# EAGLE design esp8266 (EAGLE 7.4.0)
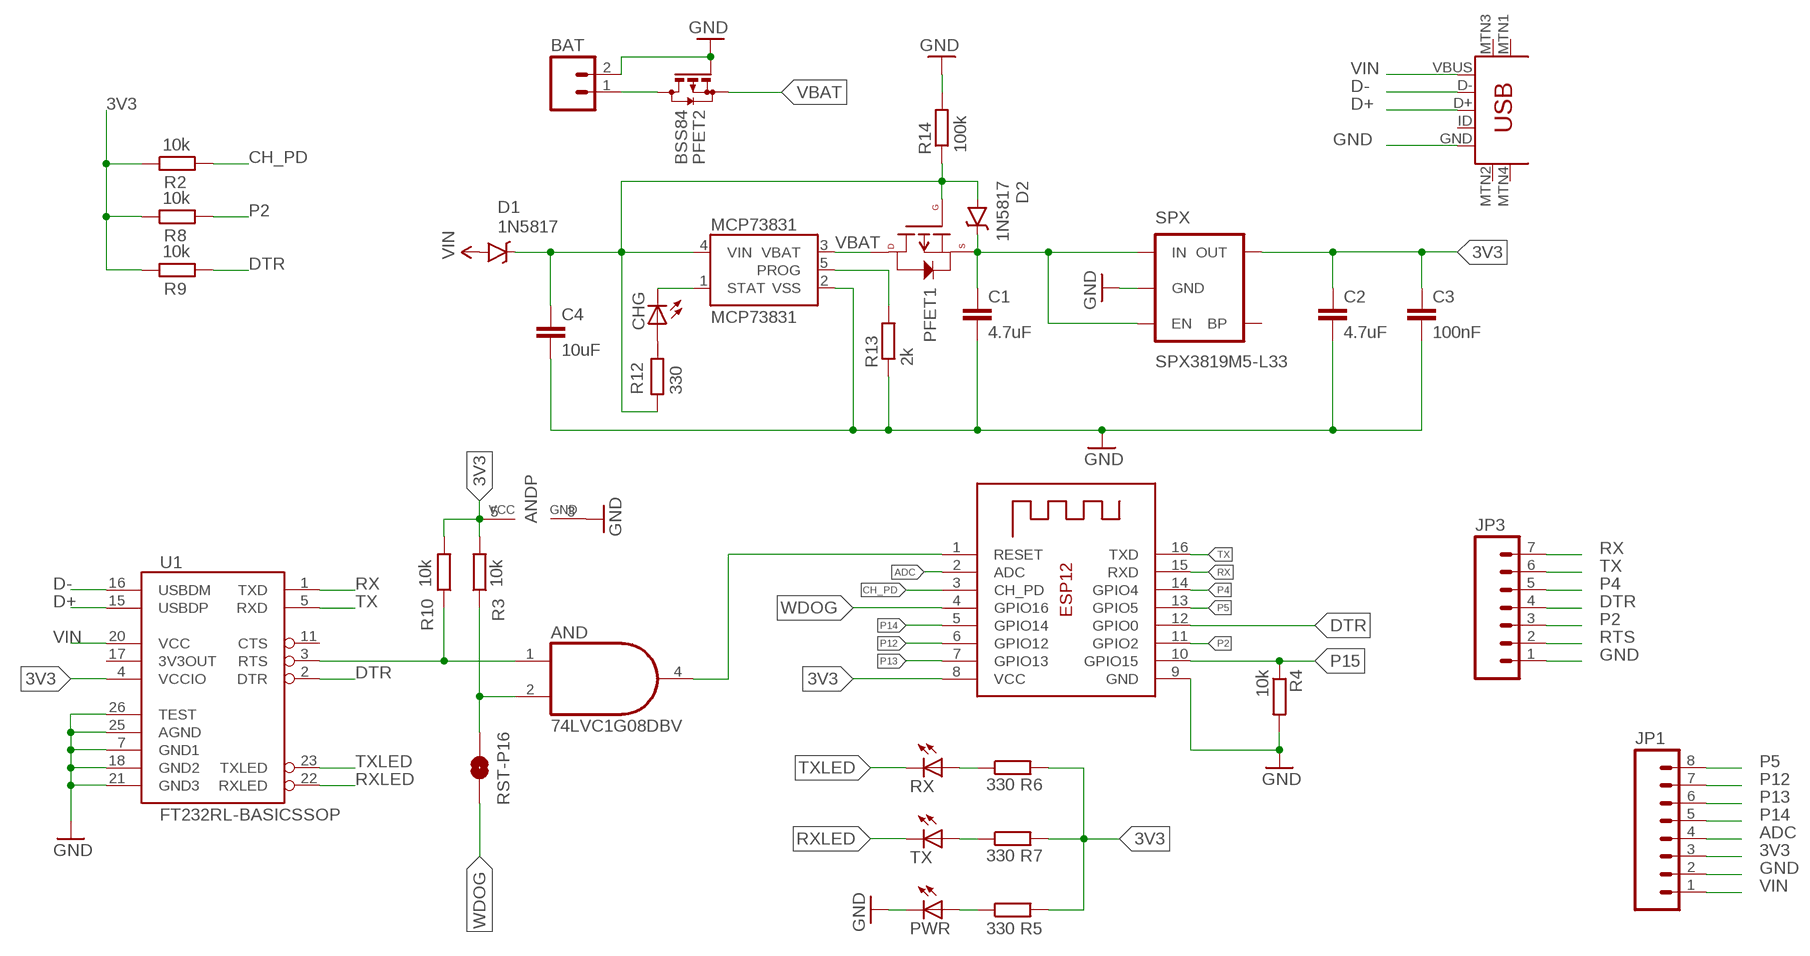
[diagram p0: schematic, sheet 1]

## Parts
AND  74LVC1G08DBV  [SOT23-5]
BAT  M02LOCK  [1X02_LOCK]
C1  4.7uF  C-EUC0805  [C0805]
C2  4.7uF  C-EUC0805  [C0805]
C3  100nF  C-EUC0805  [C0805]
C4  10uF  C-EUC0805  [C0805]
CHG  LEDCHIPLED_0805  [CHIPLED_0805]
D1  1N5817  DIODE-SCHOTTKY-MBRA140  [SMA-DIODE]
D2  1N5817  DIODE-SCHOTTKY-MBRA140  [SMA-DIODE]
ESP8266-07/12  ESP-12  [ESP-12]
JP1  M08LOCK  [1X08_LOCK]
JP3  M07LOCK  [1X07_LOCK]
MCP73831  MCP73831  [SOT23-5]
MINIUSB  USB-MINIB-5PIN  [USB-MINIB]
PFET1  P-CHANNEL-MOSFET  [SOT23-3]
PFET2  BSS84  [SOT23]
PWR  LEDCHIPLED_0805  [CHIPLED_0805]
R2  10k  R-EU_R0805  [R0805]
R3  10k  R-EU_R0805  [R0805]
R4  10k  R-EU_R0805  [R0805]
R5  330  R-EU_R0805  [R0805]
R6  330  R-EU_R0805  [R0805]
R7  330  R-EU_R0805  [R0805]
R8  10k  R-EU_R0805  [R0805]
R9  10k  R-EU_R0805  [R0805]
R10  10k  R-EU_R0805  [R0805]
R12  330  R-EU_R0805  [R0805]
R13  2k  R-EU_R0805  [R0805]
R14  100k  R-EU_R0805  [R0805]
RST-P16  SOLDERJUMPERNO  [SJ_2S-NO]
RX  LEDCHIPLED_0805  [CHIPLED_0805]
SPX  SPX3819M5-L33  V_REG_LDOSMD  [SOT23-5]
TX  LEDCHIPLED_0805  [CHIPLED_0805]
U1  FT232RL-BASICSSOP  [SSOP28DB]

## Nets
3V3 [vreg]: AND.5(VCC) C2.1 C3.1 ESP8266-07/12.8(VCC) JP1.3 R2.1 R3.2 R5.2 R6.2 R7.2 R8.1 R9.1 R10.2 SPX.5(OUT) U1.4(VCCIO)
ADC: ESP8266-07/12.2(ADC) JP1.4
CH_PD: ESP8266-07/12.3(CH_PD) R2.2
D+: MINIUSB.D+ U1.15(USBDP)
D-: MINIUSB.D- U1.16(USBDM)
DTR: ESP8266-07/12.12(GPIO0) JP3.4 R9.2 U1.2(DTR)
FTDI_RTS: AND.1(I0) R10.1 U1.3(RTS)
GND: AND.3(GND) BAT.2 C1.2 C2.2 C3.2 C4.2 ESP8266-07/12.9(GND) JP1.2 JP3.1 MCP73831.2(VSS) MINIUSB.GND PFET2.1(G) PWR.C R4.2 R13.1 R14.2 SPX.2(GND) U1.7(GND1) U1.18(GND2) U1.21(GND3) U1.25(AGND) U1.26(TEST)
N$1: PWR.A R5.1
N$2 [vcc]: C4.1 D1.C D2.A MCP73831.4(VIN) PFET1.1(G) R12.1 R14.1
N$3: CHG.A R12.2
N$4: AND.2(I1) R3.1 RST-P16.1
N$5: BAT.1 PFET2.3(D)
N$6: R6.1 RX.A
N$7: R7.1 TX.A
N$8: CHG.C MCP73831.1(STAT)
N$10: MCP73831.5(PROG) R13.2
P2: ESP8266-07/12.11(GPIO2) JP3.3 R8.2
P4: ESP8266-07/12.14(GPIO4) JP3.5
P5: ESP8266-07/12.13(GPIO5) JP1.8
P12: ESP8266-07/12.6(GPIO12) JP1.7
P13: ESP8266-07/12.7(GPIO13) JP1.6
P14: ESP8266-07/12.5(GPIO14) JP1.5
P15: ESP8266-07/12.10(GPIO15) R4.1
RTS: AND.4(O) ESP8266-07/12.1(RESET) JP3.2
RX: ESP8266-07/12.15(RXD) JP3.7 U1.1(TXD)
RXLED: TX.C U1.22(RXLED)
TX: ESP8266-07/12.16(TXD) JP3.6 U1.5(RXD)
TXLED: RX.C U1.23(TXLED)
VBAT: MCP73831.3(VBAT) PFET1.3(D) PFET2.2(S)
VIN [vcc]: D1.A JP1.1 MINIUSB.VBUS U1.20(VCC)
VRIN [vcc]: C1.1 D2.C PFET1.2(S) SPX.1(IN) SPX.3(EN)
WDOG: ESP8266-07/12.4(GPIO16) RST-P16.2
Unconnected: MINIUSB.ID MINIUSB.MTN1(MTN2) MINIUSB.MTN2(MTN3) MINIUSB.MTN3(MTN1) MINIUSB.MTN4 SPX.4(BP) U1.11(CTS) U1.17(3V3OUT)

## Library data of the parts
AND = 74xx-little-us:74*1G08: 2-input AND gate
BAT = SparkFun-Connectors:M02: Standard 2-pin 0.1" header. Use with - straight break away headers ( PRT-00116) - right angle break away headers (PRT-00553) - swiss pins (PRT-00743) - machine pins (PRT-00117) - female headers (PRT-00115) Molex polarized connector foot print use with: PRT-08233 with associated crimp pins and housings. 2.54_SCREWTERM for use with PRT-10571. 3.5mm Screw Terminal footprints for PRT-08084 5mm Screw Terminal footprints for use with PRT-08432
C1-C4 = rcl:C-EU: CAPACITOR, European symbol
CHG PWR RX TX = adafruit:LED: LED OSRAM: - CHIPLED LG R971, LG N971, LY N971, LG Q971, LY Q971, LO R971, LY R971 LH N974, LH R974 LS Q976, LO Q976, LY Q976 LO Q996 - Hyper CHIPLED LW Q18S LB Q993, LB Q99A, LB R99A - SideLED LS A670, LO A670, LY A670, LG A670, LP A670 LB A673, LV A673, LT A673, LW A673 LH A674 LY A675 LS A676, LA A676, LO A676, LY A676, LW A676 LS A679, LY A679, LG A679 - Hyper Micro SIDELED® LS Y876, LA Y876, LO Y876, LY Y876 LT Y87S - SmartLED LW L88C, LW L88S LB L89C, LB L89S, LG L890 LS L89K, LO L89K, LY L89K LS L896, LA L896, LO L896, LY L896 - TOPLED LS T670, LO T670, LY T670, LG T670, LP T670 LSG T670, LSP T670, LSY T670, LOP T670, LYG T670 LG T671, LOG T671, LSG T671 LB T673, LV T673, LT T673, LW T673 LH T674 LS T676, LA T676, LO T676, LY T676, LB T676, LH T676, LSB T676, LW T676 LB T67C, LV T67C, LT T67C, LS T67K, LO T67K, LY T67K, LW E67C LS E67B, LA E67B, LO E67B, LY E67B, LB E67C, LV E67C, LT E67C LW T67C LS T679, LY T679, LG T679 LS T770, LO T770, LY T770, LG T770, LP T770 LB T773, LV T773, LT T773, LW T773 LH T774 LS E675, LA E675, LY E675, LS T675 LS T776, LA T776, LO T776, LY T776, LB T776 LHGB T686 LT T68C, LB T68C - Hyper Mini TOPLED® LB M676 - Mini TOPLED Santana® LG M470 LS M47K, LO M47K, LY M47K Source: http://www.osram.convergy.de/
D1 D2 = SparkFun-DiscreteSemi:DIODE-SCHOTTKY: Schottky diodes in SFE's production catalog BAT20J 1A 23V 0.62Vf RB751 120mA 40V 0.37Vf PMEG4005EJ 0.5A 40V 0.42Vf MBRA140 1A 40V 0.5Vf B340A 3A 40V SMA; PROD_ID: DIO-08053; VALUE: MBRA140
ESP8266-07/12 = adafruit:ESP-12
JP1 = SparkFun-Connectors:M08: Header 8 Standard 8-pin 0.1" header. Use with straight break away headers (SKU : PRT-00116), right angle break away headers (PRT-00553), swiss pins (PRT-00743), machine pins (PRT-00117), and female headers (PRT-00115).
JP3 = SparkFun-Connectors:M07: Header 7 Standard 7-pin 0.1" header. Use with straight break away headers (SKU : PRT-00116), right angle break away headers (PRT-00553), swiss pins (PRT-00743), machine pins (PRT-00117), and female headers (PRT-00115). NOTES ON THE VARIANTS LOCK and LOCK_LONGPADS... This footprint was designed to help hold the alignment of a through-hole component (i.e. 7-pin header) while soldering it into place. You may notice that each hole has been shifted either up or down by 0.005 of an inch from it's more standard position (which is usually a perfectly straight line). This slight alteration caused the pins (the squares in the middle) to touch the edges of the holes. Because they are alternating, it causes a "brace" to hold the header in place. 0.005 has proven to be the perfect amount of "off-center" position when using our standard breakaway headers. Although looks a little odd when you look at the bare footprint, once you have a header in there, the alteration is very hard to notice. Also, if you push a header all the way into place, it is covered up entirely on the bottom side. This idea of altering the position of holes to aid alignment will be further integrated into the Sparkfun Library for other footprints. It can help hold any component with 3 or more connection pins.
MCP73831 = SparkFun-PowerIC:MCP73831: Miniature single cell, fully integrated Li-Ion, Li-polymer charge management controller http://ww1.microchip.com/downloads/en/DeviceDoc/20001984g.pdf IC-09995; PROD_ID: IC-09995
MINIUSB = SparkFun-Connectors:USB-MINIB: Mini-USB "B" connector with 5th pin broken out. Created new symbol breaking out 5th "ID" pin in mini/micro USB connector spec. See: http://en.wikipedia.org/wiki/Mini_usb#Cables. Uses same footprint as 4-pin symbol. Also added pins to connect to mounting / shield pads if required (probably not generally needed as signals aren't shielded once they leave the connector).
PFET1 = GeekAmmo:P-CHANNEL-MOSFET: P-Channel MOSFET Mode Field Effect Transistor
PFET2 = transistor-small-signal:BSS84: P-CHANNEL MOS FET
R2-R10 R12-R14 = resistor:R-EU_: RESISTOR, European symbol
RST-P16 = SparkFun-Retired:SOLDERJUMPER: Solder Jumper Standard SMD solder jumper. Used to automate production. Two varients : Normally Open and Normally Closed are the same, but have different paste layers. NC will have a large amount of paste and should jumper during reflow.
SPX = SparkFun-PowerIC:V_REG_LDO: Voltage Regulator LDO Standard 150mA LDO voltage regulator in SOT-23 layout. Micrel part MIC5205. BP (by-pass) pin is used to lower output noise with 470pF cap.
U1 = SparkFun-DigitalIC:FT232RL-BASIC: USB UART This is the simplified version of the FT232RL unit. Only what you need, nothing you don't. Spark Fun Electronics SKU : COM-00650

## Net classes
1 vcc: width 0.406 mm
2 vreg: width 0.406 mm

## Board
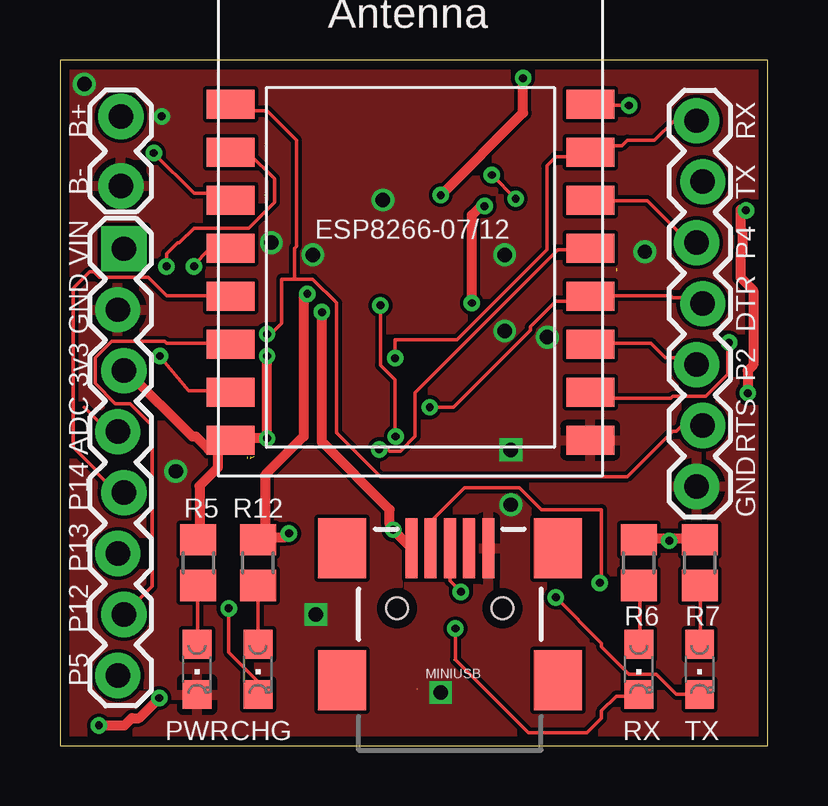
[diagram p1: board, top side]
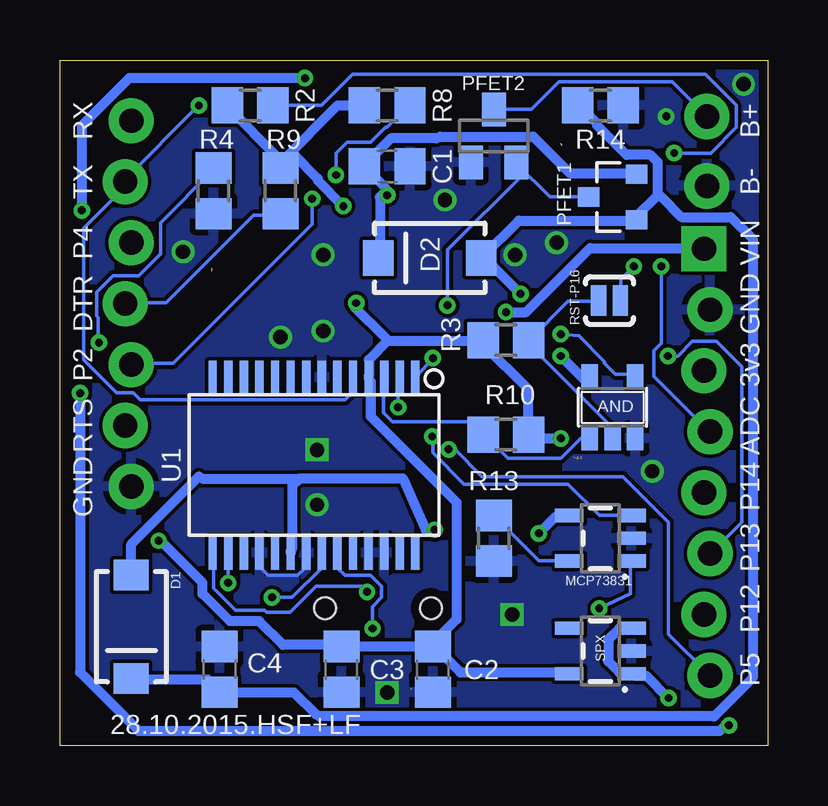
[diagram p2: board, bottom side, seen from below]

Size 29.52 x 28.56 mm. Coordinates in mm from the lower left corner, seen from the top.
Outline: 0,0 29.52,0 29.52,28.56 0,28.56 0,0
Copper layers (1*16): Top 0.0356mm / dielectric 1.5011mm / Bottom 0.0356mm
Design rules "LaenPCBOrder": minimum track width 6mil, minimum drill 13mil, track to track 6mil, track to pad 6mil, pad to pad 6mil, via to via 6mil, smd to smd 6mil, copper to edge 15mil, drill to drill 6mil, minimum pad ring 7mil, minimum via ring 7mil, stop-mask expansion 3mil, vias tented up to drill 0mil, thermal gap 10mil

### Footprints (pad centres in the part's own frame; a part is rotated, then mirrored left to right if it is on the bottom)
SOT23-5 = smd 0.69 x 0.99: 1 -0.95,-1.29; 2 0,-1.29; 3 0.95,-1.29; 4 0.95,1.3; 5 -0.95,1.3
1X02_LOCK = drill 1.016 pad 1.88: 1 -0.178,0; 2 2.718,0
C0805 = smd 1.3 x 1.5: 1 -0.95,0; 2 0.95,0
CHIPLED_0805 = smd 1.2 x 1.2: A 0,-1.05; C 0,1.05
SMA-DIODE = smd 1.27 x 1.47: A -2.15,0; C 2.15,0
ESP-12 = smd 2 x 1.2: 1 -7.5,4.5; 2 -7.5,2.5; 3 -7.5,0.5; 4 -7.5,-1.5; 5 -7.5,-3.5; 6 -7.5,-5.5; 7 -7.5,-7.5; 8 -7.5,-9.5; 9 7.5,-9.5; 10 7.5,-7.5; 11 7.5,-5.5; 12 7.5,-3.5; 13 7.5,-1.5; 14 7.5,0.5; 15 7.5,2.5; 16 7.5,4.5
1X08_LOCK = drill 1.016 pad 1.88 square: 1 0,0.127 | drill 1.016 pad 1.88: 2 2.54,-0.127; 3 5.08,0.127; 4 7.62,-0.127; 5 10.16,0.127; 6 12.7,-0.127; 7 15.24,0.127; 8 17.78,-0.127
1X07_LOCK = drill 1.016 pad 1.88: 1 0,0.127; 2 2.54,-0.127; 3 5.08,0.127; 4 7.62,-0.127; 5 10.16,0.127; 6 12.7,-0.127; 7 15.24,0.127
SOT23-5' = smd 0.55 x 1.2: 1 -0.95,-1.3; 2 0,-1.3; 3 0.95,-1.3; 4 0.95,1.3; 5 -0.95,1.3
USB-MINIB = smd 2.5 x 0.5: D+ 2.5,0; D- 2.5,0.8; GND 2.5,-1.6; ID 2.5,-0.8; VBUS 2.5,1.6 | smd 2.5 x 2: MTN1 -3,4.5; MTN2 2.5,4.5; MTN3 -3,-4.5; MTN4 2.5,-4.5 | hole 0.9: 0,2.2; 0,-2.2
SOT23-3 = smd 0.8 x 0.9: 1 -0.95,-1; 2 0.95,-1; 3 0,1
SOT23 = smd 1 x 1.4: 1 -0.95,-1.1; 2 0.95,-1.1; 3 0,1.1
R0805 = smd 1.3 x 1.5: 1 -0.95,0; 2 0.95,0
SJ_2S-NO = smd 0.635 x 1.27: 1 -0.45,0; 2 0.45,0
SSOP28DB = smd 0.348 x 1.397: 1 -4.225,-3.656; 2 -3.575,-3.656; 3 -2.925,-3.656; 4 -2.275,-3.656; 5 -1.625,-3.656; 6 -0.975,-3.656; 7 -0.325,-3.656; 8 0.325,-3.656; 9 0.975,-3.656; 10 1.625,-3.656; 11 2.275,-3.656; 12 2.925,-3.656; 13 3.575,-3.656; 14 4.225,-3.656; 15 4.225,3.656; 16 3.575,3.656; 17 2.925,3.656; 18 2.275,3.656; 19 1.625,3.656; 20 0.975,3.656; 21 0.325,3.656; 22 -0.325,3.656; 23 -0.975,3.656; 24 -1.625,3.656; 25 -2.275,3.656; 26 -2.925,3.656; 27 -3.575,3.656; 28 -4.225,3.656

### Placement (x,y rotation side)
AND  6.48,14.1 0 bottom
BAT  2.54,26.03 270 top
C1  15.88,24.13 0 bottom
C2  13.97,3.17 270 bottom
C3  17.78,3.17 270 bottom
C4  22.86,3.17 90 bottom
CHG  8.25,3.17 180 top
D1  26.54,4.95 270 bottom
D2  14.1,20.32 180 bottom
ESP8266-07/12  14.61,22.22 0 top
JP1  2.54,20.7 270 top
JP3  26.67,10.79 90 top
MCP73831  MCP73831  [SOT23-5']  6.98,8.64 90 bottom
MINIUSB  16.26,5.71 90 top
PFET1  6.48,22.86 90 bottom
PFET2  11.43,25.4 0 bottom
PWR  5.71,3.17 180 top
R2  21.59,26.67 0 bottom
R3  10.92,16.89 180 bottom
R4  23.11,23.11 270 bottom
R5  5.77,7.62 90 top
R6  24.13,7.62 90 top
R7  26.67,7.62 90 top
R8  15.88,26.67 0 bottom
R9  20.32,23.11 270 bottom
R10  10.92,12.95 0 bottom
R12  8.25,7.62 270 top
R13  11.43,8.64 90 bottom
R14  6.98,26.67 0 bottom
RST-P16  6.6,18.54 0 bottom
RX  24.13,3.17 180 top
SPX  SPX3819M5-L33  [SOT23-5']  6.98,3.94 90 bottom
TX  26.67,3.17 180 top
U1  18.92,11.68 180 bottom

### Tracks (layer width: path | path; a pad name or v marks a point on that pad's centre or on a via)
3V3  (via drill 0.33)
  Top 0.406: 25.4,8.61 26.62,8.61 R7.2 | 25.4,8.61 24.18,8.61 R6.2 | v25.4,8.53 25.4,8.61 | R5.2 5.82,8.61 5.82,10.82 6.58,11.58 6.58,12.27 7.04,12.72 ESP8266-07/12.8 | JP1.3 2.77,15.62 5.51,12.88 5.66,12.88 6.2,12.34 6.43,12.34 ESP8266-07/12.8 | ESP8266-07/12.8 7.26,12.8 v8.64,12.8 v8.64,16.23 | v17.7,22.48 17.55,22.48 17.17,22.1 v17.17,18.44
  Bottom 0.406: SPX.5 8.33,3.05 12.83,3.05 13.97,4.19 C2.1 | C2.1 14.12,4.11 C3.1 17.93,4.19 20.22,4.19 21.21,5.18 22.43,5.18 23.57,6.32 23.57,6.78 25.32,8.53 v25.4,8.53 | R9.1 20.37,24.08 20.37,24.46 22.58,26.67 R2.1 | R8.1 17.93,26.67 20.22,24.38 R9.1 | 15.88,16.84 16.64,16.08 16.64,15.39 U1.4 16.56,15.16 16.56,13.72 12.98,10.13 12.98,5.26 13.89,4.34 C2.1 | 15.88,16.84 11.91,16.84 R3.2 11.84,16.69 10.01,14.86 10.01,12.95 R10.2 9.86,12.8 v8.64,12.8 | 15.88,16.84 15.95,16.99 17.25,18.29 v17.17,18.44 | v8.64,16.23 7.64,15.24 7.57,15.24 7.49,15.32 7.49,15.39 AND.5 | v17.7,22.48 18.77,23.55 18.77,23.62 19.76,24.61 R9.1
ADC  (via drill 0.33)
  Top 0.152: 1.02,14.1 2.01,13.11 2.39,13.11 JP1.4 | v4.45,19.96 4.45,20.5 4.9,20.95 4.98,20.95 5.59,21.56 7.87,21.56 8.94,22.63 8.94,23.62 7.87,24.69 7.11,24.69 ESP8266-07/12.2
  Bottom 0.152: v4.45,19.96 4.45,16.76 4.75,16.46 4.75,15.39 2.46,13.11 JP1.4
CH_PD  (via drill 0.33)
  Top 0.152: v3.91,24.69 5.59,23.01 6.81,23.01 7.04,22.78 ESP8266-07/12.3
  Bottom 0.152: R2.2 18.62,26.67 17.32,27.97 2.62,27.97 1.32,26.67 1.32,25.76 2.39,24.69 v3.91,24.69
D+  (via drill 0.33)
  Top 0.152: v16.71,6.4 16.26,6.86 MINIUSB.D+
  Bottom 0.152: v16.71,6.4 16.94,6.63 18.85,6.63 19.91,5.56 20.9,5.56 20.98,5.64 22.2,5.64 23.11,6.55 23.11,8 U1.15
D-  (via drill 0.33)
  Top 0.152: v22.5,6.78 22.58,6.86 22.58,9.83 20.07,9.83 19.15,10.74 16.87,10.74 15.49,9.37 | 15.49,9.37 15.49,8.23 MINIUSB.D- 15.49,9.37
  Bottom 0.152: v22.5,6.78 22.5,8 U1.16
DTR  (via drill 0.33)
  Top 0.152: v15.42,14.1 16.41,14.1 19.61,17.3 19.61,17.45 20.68,18.52 21.89,18.52 22.05,18.67 ESP8266-07/12.12 22.12,18.75 25.48,18.75 25.55,18.67 26.54,18.67 JP3.4
  Bottom 0.152: v15.42,14.1 15.42,15.32 U1.2 | R9.2 20.37,22.1 21.44,22.1 25.09,18.44 26.77,18.44 JP3.4
FTDI_RTS
  Bottom 0.152: AND.1 7.49,12.8 7.8,12.8 8.64,11.96 10.85,11.96 11.84,12.95 R10.1 11.91,12.95 12.45,13.49 15.65,13.49 16.03,13.87 16.03,15.32 U1.3
GND  (via drill 0.33, 0.6)  (8 unrouted)
  Bottom 0.152: U1.21 19.3,8 19.3,7.39 19.61,7.09 20.83,7.09 21.13,7.39 21.13,8 U1.18 | 17.66,2.35 17.78,2.44 C3.2
  other vias: 18.8,12.32 4.24,26.21 15.88,2.21 10.67,5.46 1.02,27.56 18.8,10.03 20.32,17.02 13.46,22.73 24.38,20.57 18.54,20.45 10.54,20.45 8.81,20.95 4.83,11.43 18.54,17.27
  pour Bottom: -8.89,34.92 38.1,34.92 38.1,-10.8 -8.89,-10.8
  pour Top: -8.89,-10.8 38.1,-10.8 38.1,34.92 -8.89,34.92
N$1
  Top 0.152: PWR.A 5.74,4.27 5.74,6.63 R5.1
N$2  (via drill 0.33)
  Top 0.406: v9.55,8.84 9.4,8.69 8.33,8.69 8.25,8.61 R12.1 8.56,8.84 8.56,11.28 10.16,12.88 10.16,18.67 v10.31,18.82
  Bottom 0.406: 26.54,2.82 D1.C 26.39,2.74 23.34,2.74 22.88,2.29 C4.1 22.66,2.21 19.76,2.21 18.85,1.29 18.69,1.22 2.23,1.22 0.63,2.82 0.63,21.11 1.55,22.02 3.61,22.02 4.45,22.86 4.6,22.94 | v9.55,8.84 8.86,9.52 8.33,9.52 MCP73831.4 | 4.6,22.94 4.6,24.31 4.9,24.61 5.89,24.61 7.11,25.83 7.11,25.91 7.87,26.67 R14.1 | 4.6,22.94 5.44,22.1 PFET1.1 5.51,21.87 10.39,21.87 11.91,20.34 D2.A 11.76,20.27 v10.31,18.82
N$3
  Top 0.152: R12.2 CHG.A
N$4
  Bottom 0.152: AND.2 6.5,12.88 6.5,13.26 9.93,16.69 9.93,16.84 R3.1 9.93,16.92 8.33,18.52 7.11,18.52 RST-P16.1
N$5
  Bottom 0.152: BAT.1 3.99,27.66 8.71,27.66 9.86,26.52 11.38,26.52 PFET2.3
N$6
  Top 0.152: RX.A 24.18,4.27 24.18,6.63 R6.1
N$7
  Top 0.152: TX.A 26.7,4.27 26.7,6.63 R7.1
N$8  (via drill 0.33)
  Top 0.152: CHG.C 8.25,2.67 7.04,3.89 v7.04,5.71
  Bottom 0.152: 5.74,7.62 MCP73831.1 5.74,7.54 5.74,6.32 v7.04,5.71
N$10
  Bottom 0.152: MCP73831.5 8.33,7.7 9.55,7.7 11.38,9.52 R13.2
P2  (via drill 0.33)
  Top 0.152: v19,22.78 v18.01,23.77 | ESP8266-07/12.11 22.12,16.76 24.64,16.76 25.25,16.15 25.63,16.15 25.86,15.93 26.54,15.93 JP3.3
  Bottom 0.152: v18.01,23.77 18.01,24.69 17.55,25.15 16.56,25.15 15.95,25.76 15.88,25.76 14.96,26.67 R8.2 | v19,22.78 19,21.72 24.79,15.93 26.54,15.93 JP3.3
P4
  Top 0.152: JP3.5 26.24,20.95 24.49,22.71 22.12,22.71 ESP8266-07/12.14
P5  (via drill 0.33)
  Top 0.152: ESP8266-07/12.13 22.05,20.65 20.75,20.65 14.81,14.71 14.81,12.88 14.2,12.27 13.74,12.27 13.66,12.34 v13.31,12.34
  Bottom 0.152: JP1.8 4.14,4.65 4.14,9.3 6.04,11.2 11.91,11.2 13.06,12.34 v13.31,12.34
P12
  Top 0.152: JP1.7 3.83,6.63 3.83,13.33 2.92,14.25 2.31,14.25 1.47,15.09 1.47,16.15 2.16,16.84 4.37,16.84 4.45,16.76 7.04,16.76 ESP8266-07/12.6
P13  (via drill 0.33)
  Top 0.152: v4.17,16.23 5.36,14.78 7.04,14.78 ESP8266-07/12.7
  Bottom 0.152: JP1.6 2.39,8 1.09,9.3 1.09,15.77 2.16,16.84 3.15,16.84 3.76,16.23 v4.17,16.23
P14
  Top 0.152: ESP8266-07/12.5 7.04,18.75 4.45,18.75 3.68,19.51 1.63,19.51 1.4,19.74 1.24,19.74 0.56,19.05 0.56,12.42 1.55,11.43 1.55,11.35 2.31,10.59 2.62,10.59 JP1.5
P15  (via drill 0.33)
  Top 0.152: ESP8266-07/12.10 22.35,14.48 25.48,14.48 25.55,14.55 26.92,14.55 27.84,15.47 27.84,16.76 v27.89,16.79
  Bottom 0.152: R4.1 23.11,24 25.32,21.79 25.32,20.5 26.24,19.58 27.3,19.58 27.99,18.9 27.99,17.91 27.91,17.83 27.91,16.84 v27.89,16.79
RTS  (via drill 0.33)
  Top 0.152: ESP8266-07/12.1 7.11,26.67 7.34,26.44 8.64,26.44 9.86,25.22 9.86,20.8 9.78,20.73 9.78,19.43 | JP3.2 25.93,13.33 25.7,13.11 25.55,13.11 23.65,11.2 13.36,11.2 11.53,13.03 11.53,18.44 10.54,19.43 9.78,19.43 | 9.78,19.43 9.25,19.43 9.25,17.6 8.79,17.14 v8.64,17.14
  Bottom 0.152: v8.64,17.14 7.87,17.07 6.81,16 6.81,15.93 6.35,15.47 5.59,15.47 AND.4
RX  (via drill 0.33)
  Top 0.152: v13.97,16.14 13.97,16.92 16.56,16.92 20.29,20.65 20.29,24.16 20.68,24.54 21.89,24.54 22.05,24.69 ESP8266-07/12.15 | 22.35,24.99 22.12,24.77 ESP8266-07/12.15 | 26.54,25.98 JP3.7 26.54,26.06 25.63,26.06 24.79,25.22 23.65,25.22 23.42,24.99 22.35,24.99 | 22.35,24.99 ESP8266-07/12.15
  Bottom 0.152: v13.97,16.14 14.66,15.39 U1.1
RXLED  (via drill 0.33)
  Top 0.152: v20.68,6.17 22.58,4.27 22.58,4.11 23.72,2.97 24.87,2.97 25.7,2.13 26.62,2.13 TX.C
  Bottom 0.152: v20.68,6.17 19.84,6.17 18.62,7.39 18.62,8 U1.22
TX  (via drill 0.33)
  Top 0.152: v23.72,26.67 22.12,26.67 ESP8266-07/12.16
  Bottom 0.152: U1.5 17.32,15.32 17.32,14.71 17.63,14.4 26.16,14.4 26.47,14.71 27.15,14.71 28.52,16.08 28.52,21.56 26.85,23.24 26.85,23.39 JP3.6 | 26.85,23.47 JP3.6 | v23.72,26.67 26.85,23.55 JP3.6
TXLED  (via drill 0.33)
  Top 0.152: v16.48,4.88 16.48,3.58 19.53,0.53 21.97,0.53 22.58,1.14 22.58,1.45 23.19,2.06 24.1,2.06 RX.C
  Bottom 0.152: v16.48,4.88 16.48,5.79 16.1,6.17 16.1,6.63 16.56,7.09 17.63,7.09 17.93,7.39 17.93,8 U1.23
VBAT  (via drill 0.33)
  Top 0.152: v13.36,18.34 13.36,15.85 13.97,15.24 13.97,12.88 v14,12.88
  Bottom 0.152: PFET1.3 9.09,22.86 10.46,24.23 PFET2.2 10.16,23.85 13.36,20.65 v13.36,18.34 | MCP73831.3 5.74,9.6 7.04,9.6 8.33,10.9 12.68,10.9 13.97,12.19 13.97,12.88 v14,12.88
VIN  (via drill 0.33)
  Top 0.406: MINIUSB.VBUS 14.66,8.23 v13.89,8.99 13.82,9.14 13.74,9.22 13.74,9.83 10.92,12.65 v10.92,18.06
  Bottom 0.406: D1.A 26.54,8.38 23.72,11.2 23.57,11.12 19.53,11.12 | 19.91,8.08 U1.20 19.84,8.23 19.84,10.9 19.68,10.97 19.53,11.12 | v13.89,8.99 14.27,8.99 14.39,9.29 15.21,11.12 19.53,11.12 | v10.92,18.06 10.08,18.06 7.42,20.73 2.69,20.73 JP1.1
VRIN  (via drill 0.33)
  Top 0.406: v4.14,1.98 3.3,1.14 3,1.14 2.69,0.84 v1.63,0.84 | v28.68,14.68 28.68,15.62 28.91,15.85 28.91,18.97 28.37,19.51 28.37,20.5 28.45,20.57 28.45,21.41 28.37,21.49 28.37,22.33 v28.6,22.3 | v19.3,27.81 19.3,26.36 v15.88,22.94
  Bottom 0.406: SPX.3 5.74,4.88 6.2,4.88 6.65,4.42 6.65,3.5 6.2,3.05 5.74,3.05 SPX.1 5.51,2.9 5.05,2.9 v4.14,1.98 | PFET1.2 5.51,23.85 8.25,23.85 9.78,25.38 13.66,25.38 13.82,25.3 15.72,25.3 16.71,24.31 C1.1 16.79,24.08 15.95,23.24 v15.88,22.94 15.99,23.05 16.18,22.86 16.18,20.34 D2.C | v1.63,0.84 1.78,0.84 2.01,0.61 26.24,0.61 28.68,3.05 v28.68,14.68 | v28.6,22.3 28.6,25.83 26.62,27.81 v19.3,27.81
WDOG  (via drill 0.33)
  Top 0.152: v5.59,19.96 5.59,20.04 6.2,20.65 7.04,20.65 ESP8266-07/12.4
  Bottom 0.152: v5.59,19.96 6.12,19.43 6.12,18.59 RST-P16.2

### Text on the board
tNames: B+ | RX | B- | TX | VIN | P4 | GND | DTR | 3v3 | P2 | ADC | RTS | P14 | GND | P13 | P12 | P5
bNames: B+ | RX | B- | TX | VIN | P4 | GND | DTR | 3v3 | P2 | ADC | RTS | P14 | GND | P13 | P12 | P5 | 28.10.2015.HSF+LF